# EAGLE design cpu_card (EAGLE 4.16)
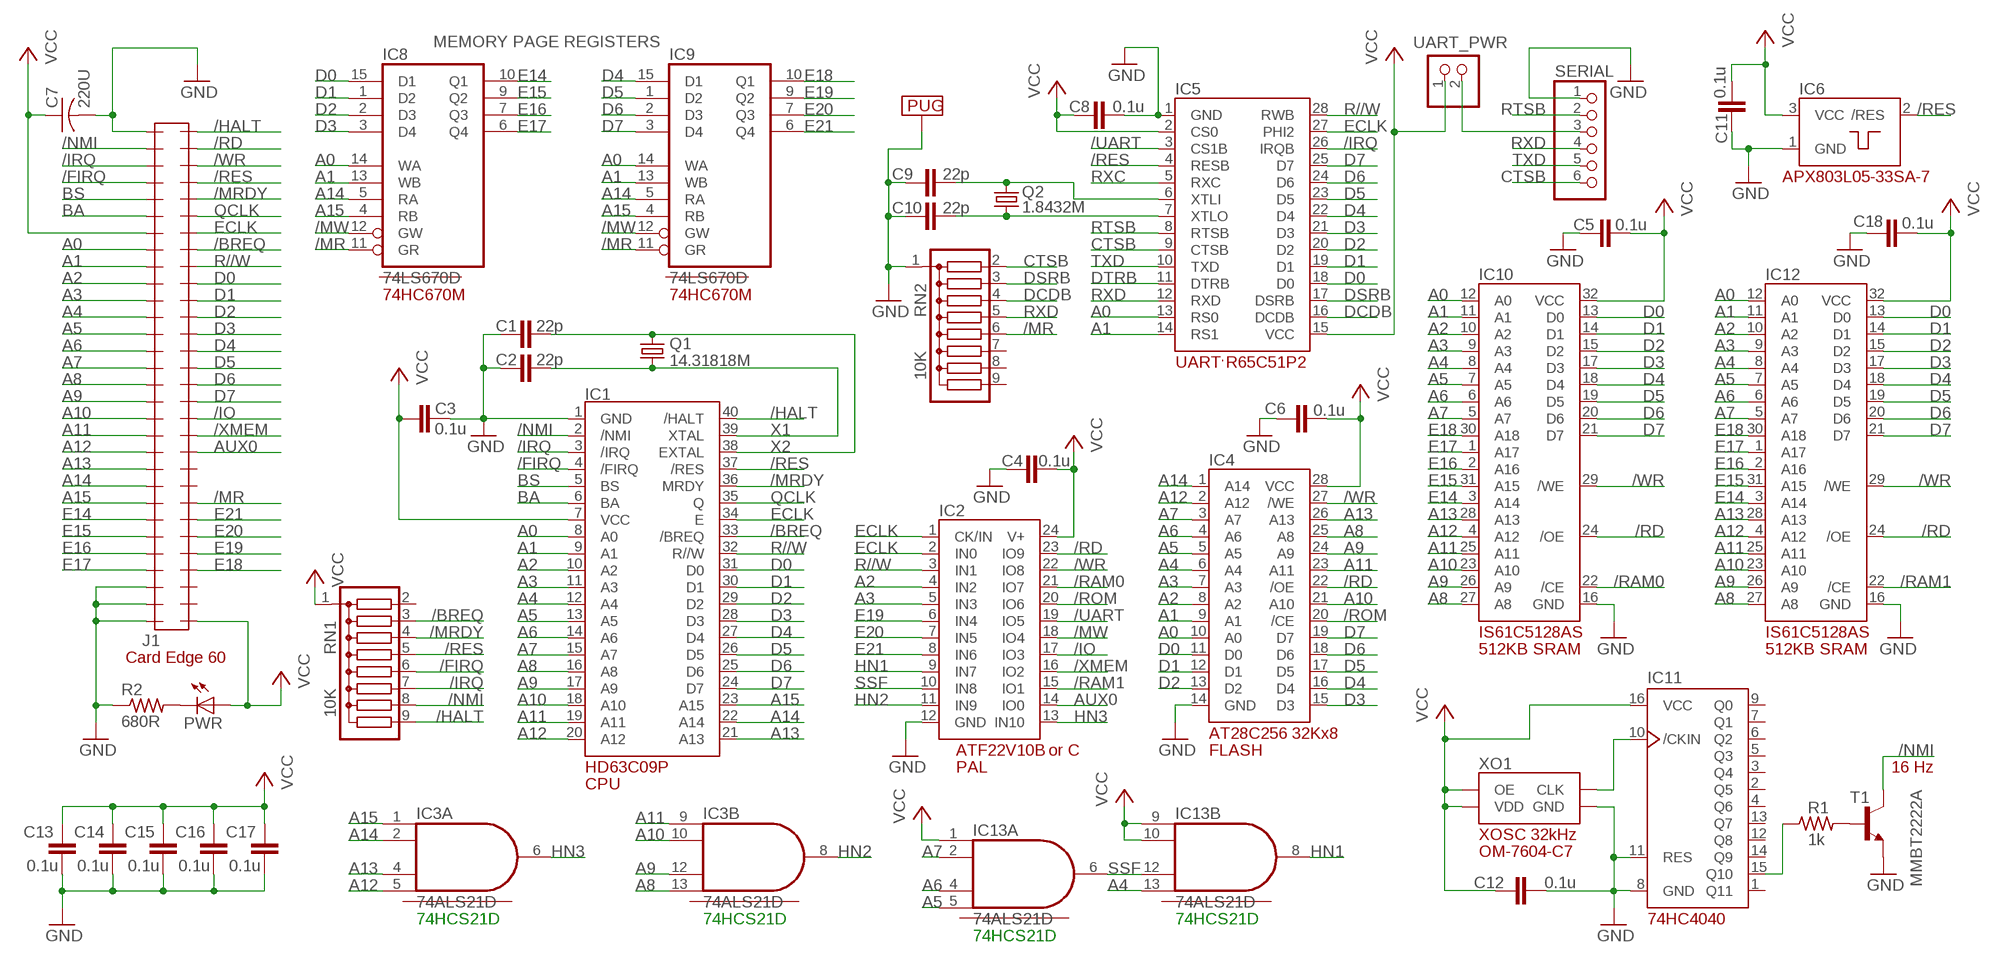
[diagram p0: schematic, sheet 1]

## Parts
C1  22p  C-EUC0603  [C0603]
C2  22p  C-EUC0603  [C0603]
C3  0.1u  C-EUC0603  [C0603]
C4  0.1u  C-EUC0603  [C0603]
C5  0.1u  C-EUC0603  [C0603]
C6  0.1u  C-EUC0603  [C0603]
C7  220U  C-US025-050X050  [C025-050X050]
C8  0.1u  C-EUC0603  [C0603]
C9  22p  C-EUC0603  [C0603]
C10  22p  C-EUC0603  [C0603]
C11  0.1u  C-EUC0603  [C0603]
C12  0.1u  C-EUC0603  [C0603]
C13  0.1u  C-EUC0603  [C0603]
C14  0.1u  C-EUC0603  [C0603]
C15  0.1u  C-EUC0603  [C0603]
C16  0.1u  C-EUC0603  [C0603]
C17  0.1u  C-EUC0603  [C0603]
C18  0.1u  C-EUC0603  [C0603]
IC1  HD63C09P  [DIL40]
IC2  PLD_ATF22V10B  [DIL24-3]
IC3  74ALS21D  [SO14]
IC4  EEP_32KX8_AT28C256  [DIL28-6]
IC5  UART_W65C51N  [DIL28-6]
IC6  POR_APX803L05-33SA-7  [SOT23]
IC8  74LS670D  [SO16]
IC9  74LS670D  [SO16]
IC10  IS61C5128AS  [SOIC32_11.3MM_WID]
IC11  74HC4040D  [SO16]
IC12  IS61C5128AS  [SOIC32_11.3MM_WID]
IC13  74ALS21D  [SO14]
J1  CARDEDGE_2.54_60POS  CARDEDGE_2.54_60POSEDGE  [CARDEDGE_2.54_60POS]
PWR  LED3MM  [LED3MM]
Q1  14.31818M  CRYSTALHC49S  [HC49/S]
Q2  1.8432M  CRYSTALHC49S  [HC49/S]
R1  1k  R-US_R0603  [R0603]
R2  680R  R-US_R0603  [R0603]
RN1  10K  G08R  [SIL9]
RN2  10K  G08R  [SIL9]
SERIAL  PINHD-1X6  [1X06]
T1  MMBT2222A  MMBT2222ALT1-NPN-SOT23-BEC  [SOT23-BEC]
U$2  PUG  [LARGE_PUG]
UART_PWR  PINHD-1X2  [1X02]
XO1  XODC_32KHZ_OM-7604-C7  [32K_XO_OM-7604-C7]

## Nets
/BREQ: IC1.33(/BREQ) J1.53 RN1.3
/FIRQ: IC1.4(/FIRQ) J1.4 RN1.6
/HALT: IC1.40(/HALT) J1.60 RN1.9
/IO: IC2.17(IO3) J1.43
/IRQ: IC1.3(/IRQ) IC5.26(IRQB) J1.3 RN1.7
/MR: IC8.11(GR) IC9.11(GR) J1.38 RN2.6
/MRDY: IC1.36(MRDY) J1.56 RN1.4
/MW: IC2.18(IO4) IC8.12(GW) IC9.12(GW)
/NMI: IC1.2(/NMI) J1.2 RN1.8 T1.C
/RAM0: IC2.21(IO7) IC10.22(/CE)
/RAM1: IC2.15(IO1) IC12.22(/CE)
/RD: IC2.23(IO9) IC4.22(/OE) IC10.24(/OE) IC12.24(/OE) J1.59
/RES: IC1.37(/RES) IC5.4(RESB) IC6.2(/RES) J1.57 RN1.5
/ROM: IC2.20(IO6) IC4.20(/CE)
/UART: IC2.19(IO5) IC5.3(CS1B)
/WR: IC2.22(IO8) IC4.27(/WE) IC10.29(/WE) IC12.29(/WE) J1.58
/XMEM: IC2.16(IO2) J1.42
A0: IC1.8(A0) IC4.10(A0) IC5.13(RS0) IC8.14(WA) IC9.14(WA) IC10.12(A0) IC12.12(A0) J1.8
A1: IC1.9(A1) IC4.9(A1) IC5.14(RS1) IC8.13(WB) IC9.13(WB) IC10.11(A1) IC12.11(A1) J1.9
A2: IC1.10(A2) IC2.4(IN2) IC4.8(A2) IC10.10(A2) IC12.10(A2) J1.10
A3: IC1.11(A3) IC2.5(IN3) IC4.7(A3) IC10.9(A3) IC12.9(A3) J1.11
A4: IC1.12(A4) IC4.6(A4) IC10.8(A4) IC12.8(A4) IC13.13(B:I3) J1.12
A5: IC1.13(A5) IC4.5(A5) IC10.7(A5) IC12.7(A5) IC13.5(A:I3) J1.13
A6: IC1.14(A6) IC4.4(A6) IC10.6(A6) IC12.6(A6) IC13.4(A:I2) J1.14
A7: IC1.15(A7) IC4.3(A7) IC10.5(A7) IC12.5(A7) IC13.2(A:I1) J1.15
A8: IC1.16(A8) IC3.13(B:I3) IC4.25(A8) IC10.27(A8) IC12.27(A8) J1.16
A9: IC1.17(A9) IC3.12(B:I2) IC4.24(A9) IC10.26(A9) IC12.26(A9) J1.17
A10: IC1.18(A10) IC3.10(B:I1) IC4.21(A10) IC10.23(A10) IC12.23(A10) J1.18
A11: IC1.19(A11) IC3.9(B:I0) IC4.23(A11) IC10.25(A11) IC12.25(A11) J1.19
A12: IC1.20(A12) IC3.5(A:I3) IC4.2(A12) IC10.4(A12) IC12.4(A12) J1.20
A13: IC1.21(A13) IC3.4(A:I2) IC4.26(A13) IC10.28(A13) IC12.28(A13) J1.21
A14: IC1.22(A14) IC3.2(A:I1) IC4.1(A14) IC8.5(RA) IC9.5(RA) J1.22
A15: IC1.23(A15) IC3.1(A:I0) IC8.4(RB) IC9.4(RB) J1.23
AUX0: IC2.14(IO0) J1.41
BA: IC1.6(BA) J1.6
BS: IC1.5(BS) J1.5
CTSB: IC5.9(CTSB) RN2.2 SERIAL.6
D0: IC1.31(D0) IC4.11(D0) IC5.18(D0) IC8.15(D1) IC10.13(D0) IC12.13(D0) J1.51
D1: IC1.30(D1) IC4.12(D1) IC5.19(D1) IC8.1(D2) IC10.14(D1) IC12.14(D1) J1.50
D2: IC1.29(D2) IC4.13(D2) IC5.20(D2) IC8.2(D3) IC10.15(D2) IC12.15(D2) J1.49
D3: IC1.28(D3) IC4.15(D3) IC5.21(D3) IC8.3(D4) IC10.17(D3) IC12.17(D3) J1.48
D4: IC1.27(D4) IC4.16(D4) IC5.22(D4) IC9.15(D1) IC10.18(D4) IC12.18(D4) J1.47
D5: IC1.26(D5) IC4.17(D5) IC5.23(D5) IC9.1(D2) IC10.19(D5) IC12.19(D5) J1.46
D6: IC1.25(D6) IC4.18(D6) IC5.24(D6) IC9.2(D3) IC10.20(D6) IC12.20(D6) J1.45
D7: IC1.24(D7) IC4.19(D7) IC5.25(D7) IC9.3(D4) IC10.21(D7) IC12.21(D7) J1.44
DCDB: IC5.16(DCDB) RN2.4
DSRB: IC5.17(DSRB) RN2.3
DTRB: IC5.11(DTRB)
E14: IC8.10(Q1) IC10.3(A14) IC12.3(A14) J1.24
E15: IC8.9(Q2) IC10.31(A15) IC12.31(A15) J1.25
E16: IC8.7(Q3) IC10.2(A16) IC12.2(A16) J1.26
E17: IC8.6(Q4) IC10.1(A17) IC12.1(A17) J1.27
E18: IC9.10(Q1) IC10.30(A18) IC12.30(A18) J1.34
E19: IC2.6(IN4) IC9.9(Q2) J1.35
E20: IC2.7(IN5) IC9.7(Q3) J1.36
E21: IC2.8(IN6) IC9.6(Q4) J1.37
ECLK: IC1.34(E) IC2.1(CK/IN) IC2.2(IN0) IC5.27(PHI2) J1.54
GND [supply]: C1.1 C2.1 C3.2 C4.1 C5.1 C6.1 C7.2 C8.2 C9.1 C10.1 C11.2 C12.2 C13.2 C14.2 C15.2 C16.2 C17.2 C18.1 IC1.1(GND) IC2.12(GND) IC4.14(GND) IC5.1(GND) IC6.1(GND) IC10.16(GND) IC11.8(GND) IC11.11(RES) IC12.16(GND) J1.1 J1.28 J1.29 J1.30 R2.1 RN2.1 SERIAL.1 T1.E U$2.P$1 XO1.GND
HN1: IC2.9(IN7) IC13.8(B:O)
HN2: IC2.11(IN9) IC3.8(B:O)
HN3: IC2.13(IN10) IC3.6(A:O)
N$1: R1.2 T1.B
N$2: PWR.K(C) R2.2
N$3: IC11.15(Q10) R1.1
N$4 [supply]: SERIAL.3 UART_PWR.2
N$5: IC11.10(/CKIN) XO1.CKOUT(CLK)
N$20: C9.2 IC5.6(XTLI) Q2.2
N$21: C10.2 IC5.7(XTLO) Q2.1
QCLK: IC1.35(Q) J1.55
R//W: IC1.32(R//W) IC2.3(IN1) IC5.28(RWB) J1.52
RTSB: IC5.8(RTSB) SERIAL.2
RXC: IC5.5(RXC)
RXD: IC5.12(RXD) RN2.5 SERIAL.4
SSF: IC2.10(IN8) IC13.6(A:O) IC13.12(B:I2)
TXD: IC5.10(TXD) SERIAL.5
VCC [supply]: C3.1 C4.2 C5.2 C6.2 C7.1 C8.1 C11.1 C12.1 C13.1 C14.1 C15.1 C16.1 C17.1 C18.2 IC1.7(VCC) IC2.24(V+) IC4.28(VCC) IC5.2(CS0) IC5.15(VCC) IC6.3(VCC) IC10.32(VCC) IC11.16(VCC) IC12.32(VCC) IC13.1(A:I0) IC13.9(B:I0) IC13.10(B:I1) J1.7 J1.31 PWR.A RN1.1 UART_PWR.1 XO1.OE XO1.VDD
X1: C2.2 IC1.39(XTAL) Q1.1
X2: C1.2 IC1.38(EXTAL) Q1.2
Unconnected: IC11.1(Q11) IC11.2(Q5) IC11.3(Q4) IC11.4(Q6) IC11.5(Q3) IC11.6(Q2) IC11.7(Q1) IC11.9(Q0) IC11.12(Q8) IC11.13(Q7) IC11.14(Q9) J1.32 J1.33 J1.39 J1.40 RN1.2 RN2.7 RN2.8 RN2.9

## Notes on the sheet
- MEMORY PAGE REGISTERS
- 74HC670M | 74HC670M
- 512KB SRAM | 512KB SRAM
- or C | FLASH
- PAL | 16 Hz
- CPU
- 74HCS21D | 74HCS21D | 74HCS21D
- 74HCS21D

## Power pins joined to a net without a drawn wire
GND: IC3.7(P:GND) IC8.8(GND) IC9.8(GND) IC13.7(P:GND)
VCC: IC3.14(P:VCC) IC8.16(VCC) IC9.16(VCC) IC13.14(P:VCC)

## Library data of the parts
C1-C6 C8-C18 = rcl:C-EU: CAPACITOR, European symbol
C7 = rcl:C-US: CAPACITOR, American symbol
IC1 = 07-Retrocomputing:HD63C09P
IC2 = 07-Retrocomputing:PLD_ATF22V10B
IC3 IC13 = 74xx-us:74*21: Dual 4-input AND gate
IC4 = 07-Retrocomputing:EEP_32KX8_AT28C256
IC5 = 07-Retrocomputing:UART_W65C51N
IC6 = 07-Retrocomputing:POR_APX803L05-33SA-7
IC8 IC9 = 74xx-us:74*670: 4 by 4 REGISTER FILES, 3-state
IC10 IC12 = 07-Retrocomputing:IS61C5128AS
IC11 = 07-Retrocomputing:74HC4040
J1 = 07-Retrocomputing:CARDEDGE_2.54_60POS
PWR = led:LED: LED OSRAM: - CHIPLED LG R971, LG N971, LY N971, LG Q971, LY Q971, LO R971, LY R971 LH N974, LH R974 LS Q976, LO Q976, LY Q976 LO Q996 - Hyper CHIPLED LW Q18S LB Q993, LB Q99A, LB R99A - SideLED LS A670, LO A670, LY A670, LG A670, LP A670 LB A673, LV A673, LT A673, LW A673 LH A674 LY A675 LS A676, LA A676, LO A676, LY A676, LW A676 LS A679, LY A679, LG A679 - Hyper Micro SIDELED® LS Y876, LA Y876, LO Y876, LY Y876 LT Y87S - SmartLED LW L88C, LW L88S LB L89C, LB L89S, LG L890 LS L89K, LO L89K, LY L89K LS L896, LA L896, LO L896, LY L896 - TOPLED LS T670, LO T670, LY T670, LG T670, LP T670 LSG T670, LSP T670, LSY T670, LOP T670, LYG T670 LG T671, LOG T671, LSG T671 LB T673, LV T673, LT T673, LW T673 LH T674 LS T676, LA T676, LO T676, LY T676, LB T676, LH T676, LSB T676, LW T676 LB T67C, LV T67C, LT T67C, LS T67K, LO T67K, LY T67K, LW E67C LS E67B, LA E67B, LO E67B, LY E67B, LB E67C, LV E67C, LT E67C LW T67C LS T679, LY T679, LG T679 LS T770, LO T770, LY T770, LG T770, LP T770 LB T773, LV T773, LT T773, LW T773 LH T774 LS E675, LA E675, LY E675, LS T675 LS T776, LA T776, LO T776, LY T776, LB T776 LHGB T686 LT T68C, LB T68C - Hyper Mini TOPLED® LB M676 - Mini TOPLED Santana® LG M470 LS M47K, LO M47K, LY M47K Source: http://www.osram.convergy.de - LUMILED® LXK2-PW12-R00, LXK2-PW12-S00, LXK2-PW14-U00, LXK2-PW14-V00 LXK2-PM12-R00, LXK2-PM12-S00, LXK2-PM14-U00 LXK2-PE12-Q00, LXK2-PE12-R00, LXK2-PE12-S00, LXK2-PE14-T00, LXK2-PE14-U00 LXK2-PB12-K00, LXK2-PB12-L00, LXK2-PB12-M00, LXK2-PB14-N00, LXK2-PB14-P00, LXK2-PB14-Q00 LXK2-PR12-L00, LXK2-PR12-M00, LXK2-PR14-Q00, LXK2-PR14-R00 LXK2-PD12-Q00, LXK2-PD12-R00, LXK2-PD12-S00 LXK2-PH12-R00, LXK2-PH12-S00 LXK2-PL12-P00, LXK2-PL12-Q00, LXK2-PL12-R00 Source: www.luxeon.com
Q1 Q2 = crystal:CRYSTAL: CRYSTAL
R1 R2 = rcl:R-US_: RESISTOR, American symbol
RN1 RN2 = resistor-sil:G08R: SIL RESISTOR
SERIAL = pinhead:PINHD-1X6: PIN HEADER
T1 = transistor:*-NPN-: NPN Transistror
U$2 = 07-Retrocomputing:PUG
UART_PWR = pinhead:PINHD-1X2: PIN HEADER
XO1 = 07-Retrocomputing:XODC_32KHZ_OM-7604-C7

## Net classes
0 default: width 0.203 mm, drill 0.203 mm, clearance 0.254 mm
1 supply: width 0.61 mm, drill 0.203 mm, clearance 0.305 mm

## Board
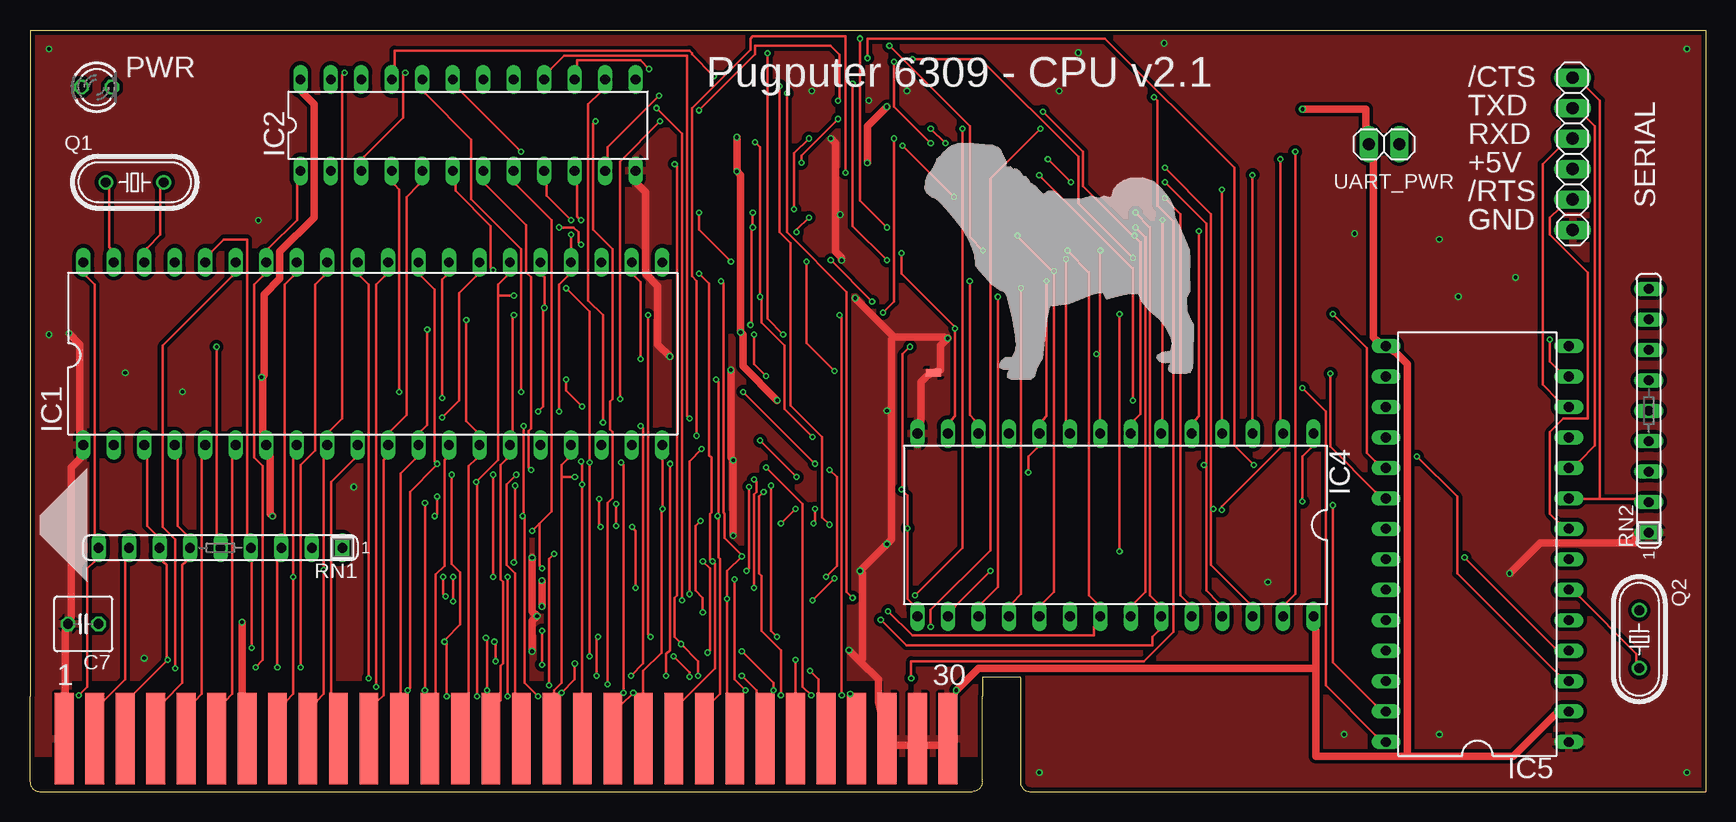
[diagram p1: board, top side]
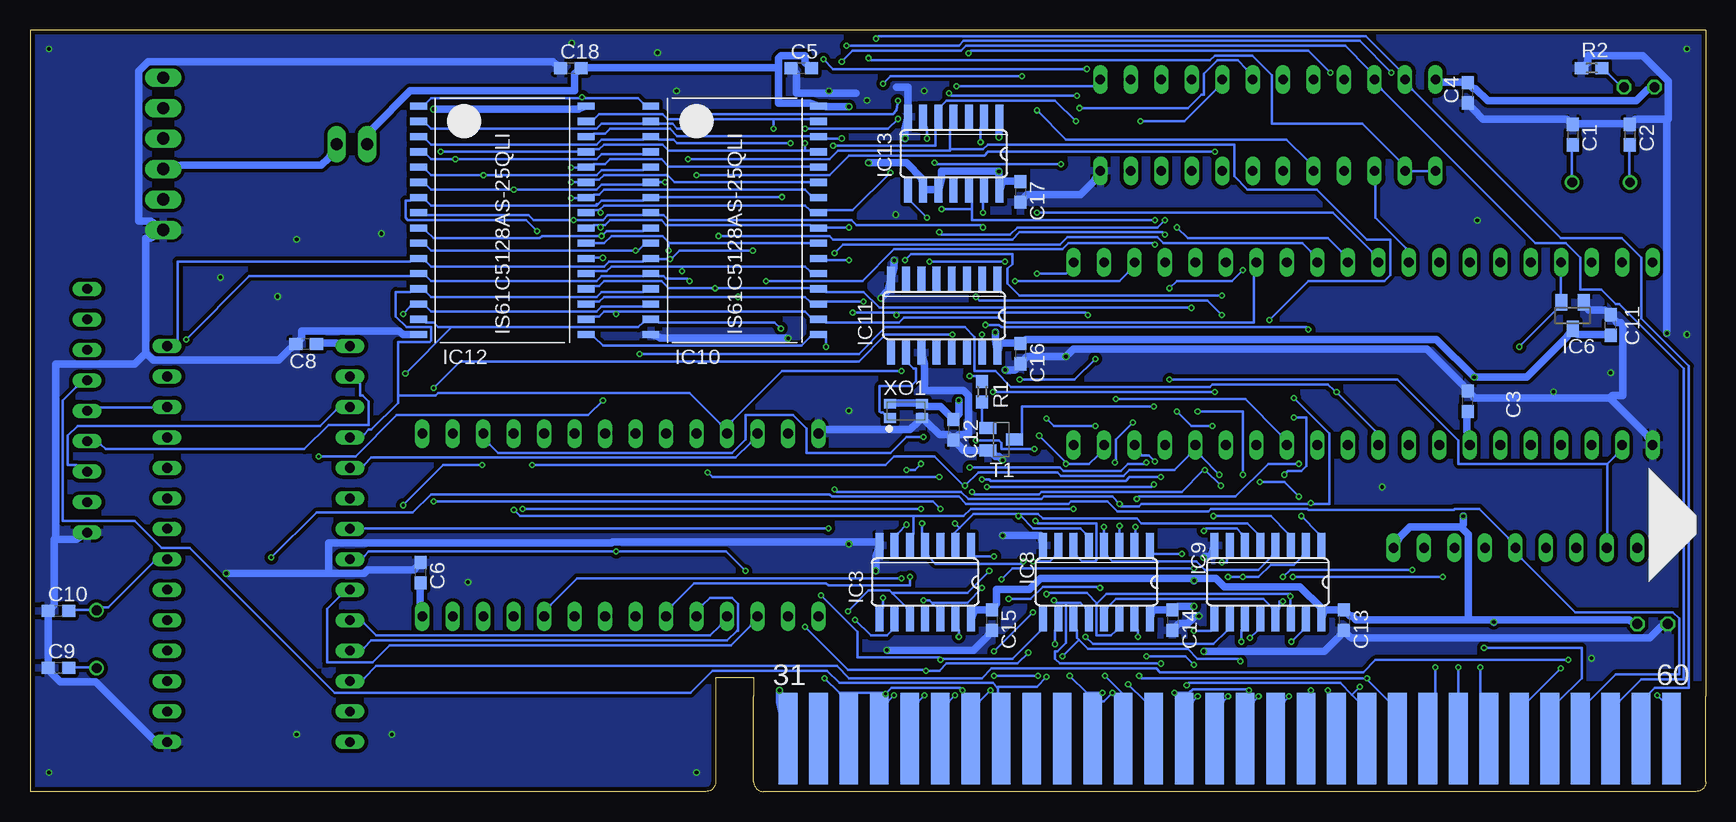
[diagram p2: board, bottom side, seen from below]

Size 139.7 x 63.5 mm. Coordinates in mm from the lower left corner, seen from the top.
Outline: 0,7.94 0,63.5 139.7,63.5 139.7,0 83.34,0 arc-90 82.55,0.79 82.55,9.53 79.38,9.53 79.38,7.94
Copper layers (1*16): Top 0.0356mm / dielectric 1.6mm / Bottom 0.0356mm
Design rules "oshpark-2layer": minimum track width 6mil, minimum drill 10mil, track to track 6mil, track to pad 6mil, pad to pad 6mil, via to via 6mil, smd to smd 6mil, copper to edge 15mil, drill to drill 6mil, minimum pad ring 5mil, minimum via ring 5mil, stop-mask expansion 2.5mil, vias tented up to drill 0mil, thermal gap 10mil

### Footprints (pad centres in the part's own frame; a part is rotated, then mirrored left to right if it is on the bottom)
C0603 = smd 1.1 x 1: 1 -0.85,0; 2 0.85,0
C025-050X050 = drill 0.813 octagon: 1 -1.27,0; 2 1.27,0
DIL40 = drill 0.813 long: 1 -24.13,-7.62; 2 -21.59,-7.62; 3 -19.05,-7.62; 4 -16.51,-7.62; 5 -13.97,-7.62; 6 -11.43,-7.62; 7 -8.89,-7.62; 8 -6.35,-7.62; 9 -3.81,-7.62; 10 -1.27,-7.62; 11 1.27,-7.62; 12 3.81,-7.62; 13 6.35,-7.62; 14 8.89,-7.62; 15 11.43,-7.62; 16 13.97,-7.62; 17 16.51,-7.62; 18 19.05,-7.62; 19 21.59,-7.62; 20 24.13,-7.62; 21 24.13,7.62; 22 21.59,7.62; 23 19.05,7.62; 24 16.51,7.62; 25 13.97,7.62; 26 11.43,7.62; 27 8.89,7.62; 28 6.35,7.62; 29 3.81,7.62; 30 1.27,7.62; 31 -1.27,7.62; 32 -3.81,7.62; 33 -6.35,7.62; 34 -8.89,7.62; 35 -11.43,7.62; 36 -13.97,7.62; 37 -16.51,7.62; 38 -19.05,7.62; 39 -21.59,7.62; 40 -24.13,7.62
DIL24-3 = drill 0.813 long: 1 -13.97,-3.81; 2 -11.43,-3.81; 3 -8.89,-3.81; 4 -6.35,-3.81; 5 -3.81,-3.81; 6 -1.27,-3.81; 7 1.27,-3.81; 8 3.81,-3.81; 9 6.35,-3.81; 10 8.89,-3.81; 11 11.43,-3.81; 12 13.97,-3.81; 13 13.97,3.81; 14 11.43,3.81; 15 8.89,3.81; 16 6.35,3.81; 17 3.81,3.81; 18 1.27,3.81; 19 -1.27,3.81; 20 -3.81,3.81; 21 -6.35,3.81; 22 -8.89,3.81; 23 -11.43,3.81; 24 -13.97,3.81
SO14 = smd 0.66 x 2.032: 1 -3.81,-3.073; 2 -2.54,-3.073; 3 -1.27,-3.073; 4 0,-3.073; 5 1.27,-3.073; 6 2.54,-3.073; 7 3.81,-3.073; 8 3.81,3.073; 9 2.54,3.073; 10 1.27,3.073; 11 0,3.073; 12 -1.27,3.073; 13 -2.54,3.073; 14 -3.81,3.073
DIL28-6 = drill 0.813 long: 1 -16.51,-7.62; 2 -13.97,-7.62; 3 -11.43,-7.62; 4 -8.89,-7.62; 5 -6.35,-7.62; 6 -3.81,-7.62; 7 -1.27,-7.62; 8 1.27,-7.62; 9 3.81,-7.62; 10 6.35,-7.62; 11 8.89,-7.62; 12 11.43,-7.62; 13 13.97,-7.62; 14 16.51,-7.62; 15 16.51,7.62; 16 13.97,7.62; 17 11.43,7.62; 18 8.89,7.62; 19 6.35,7.62; 20 3.81,7.62; 21 1.27,7.62; 22 -1.27,7.62; 23 -3.81,7.62; 24 -6.35,7.62; 25 -8.89,7.62; 26 -11.43,7.62; 27 -13.97,7.62; 28 -16.51,7.62
SOT23 = smd 1 x 1.4: 1 -0.95,-1.1; 2 0.95,-1.1; 3 0,1.1
SO16 = smd 0.66 x 2.032: 1 -4.445,-3.073; 2 -3.175,-3.073; 3 -1.905,-3.073; 4 -0.635,-3.073; 5 0.635,-3.073; 6 1.905,-3.073; 7 3.175,-3.073; 8 4.445,-3.073; 9 4.445,3.073; 10 3.175,3.073; 11 1.905,3.073; 12 0.635,3.073; 13 -0.635,3.073; 14 -1.905,3.073; 15 -3.175,3.073; 16 -4.445,3.073
SOIC32_11.3MM_WID = smd 1.4 x 0.6: 1 -6.985,9.525; 2 -6.985,8.255; 3 -6.985,6.985; 4 -6.985,5.715; 5 -6.985,4.445; 6 -6.985,3.175; 7 -6.985,1.905; 8 -6.985,0.635; 9 -6.985,-0.635; 10 -6.985,-1.905; 11 -6.985,-3.175; 12 -6.985,-4.445; 13 -6.985,-5.715; 14 -6.985,-6.985; 15 -6.985,-8.255; 16 -6.985,-9.525; 17 6.985,-9.525; 18 6.985,-8.255; 19 6.985,-6.985; 20 6.985,-5.715; 21 6.985,-4.445; 22 6.985,-3.175; 23 6.985,-1.905; 24 6.985,-0.635; 25 6.985,0.635; 26 6.985,1.905; 27 6.985,3.175; 28 6.985,4.445; 29 6.985,5.715; 30 6.985,6.985; 31 6.985,8.255; 32 6.985,9.525
CARDEDGE_2.54_60POS = smd 1.556 x 7.62: 1 -36.83,4.41; 2 -34.29,4.41; 3 -31.75,4.41; 4 -29.21,4.41; 5 -26.67,4.41; 6 -24.13,4.41; 7 -21.59,4.41; 8 -19.05,4.41; 9 -16.51,4.41; 10 -13.97,4.41; 11 -11.43,4.41; 12 -8.89,4.41; 13 -6.35,4.41; 14 -3.81,4.41; 15 -1.27,4.41; 16 1.27,4.41; 17 3.81,4.41; 18 6.35,4.41; 19 8.89,4.41; 20 11.43,4.41; 21 13.97,4.41; 22 16.51,4.41; 23 19.05,4.41; 24 21.59,4.41; 25 24.13,4.41; 26 26.67,4.41; 27 29.21,4.41; 28 31.75,4.41; 29 34.29,4.41; 30 36.83,4.41 | smd 1.556 x 7.62 bottom: 31 36.83,4.41; 32 34.29,4.41; 33 31.75,4.41; 34 29.21,4.41; 35 26.67,4.41; 36 24.13,4.41; 37 21.59,4.41; 38 19.05,4.41; 39 16.51,4.41; 40 13.97,4.41; 41 11.43,4.41; 42 8.89,4.41; 43 6.35,4.41; 44 3.81,4.41; 45 1.27,4.41; 46 -1.27,4.41; 47 -3.81,4.41; 48 -6.35,4.41; 49 -8.89,4.41; 50 -11.43,4.41; 51 -13.97,4.41; 52 -16.51,4.41; 53 -19.05,4.41; 54 -21.59,4.41; 55 -24.13,4.41; 56 -26.67,4.41; 57 -29.21,4.41; 58 -31.75,4.41; 59 -34.29,4.41; 60 -36.83,4.41
LED3MM = drill 0.813 octagon: A -1.27,0; K 1.27,0
HC49/S = drill 0.813 round: 1 -2.413,0; 2 2.413,0
R0603 = smd 1.1 x 1: 1 -0.85,0; 2 0.85,0
SIL9 = drill 0.813 long: 1 -10.16,0; 2 -7.62,0; 3 -5.08,0; 4 -2.54,0; 5 0,0; 6 2.54,0; 7 5.08,0; 8 7.62,0; 9 10.16,0
1X06 = drill 1.016 long: 1 -6.35,0; 2 -3.81,0; 3 -1.27,0; 4 1.27,0; 5 3.81,0; 6 6.35,0
SOT23-BEC = smd 1 x 1.4: B -0.95,-1.1; C 0,1.1; E 0.95,-1.1
LARGE_PUG = smd 1.27 x 0.635: P$1 2.286,3.962
1X02 = drill 1.016 long: 1 -1.27,0; 2 1.27,0
32K_XO_OM-7604-C7 = smd 1 x 0.8: CKOUT -1.35,-0.6; GND 1.35,-0.6; OE 1.35,0.6; VDD -1.35,0.6

### Placement (x,y rotation side)
C1  11.11,54.77 270 bottom
C2  6.35,54.77 270 bottom
C3  19.84,32.54 90 bottom
C4  19.84,58.26 90 bottom
C5  75.41,60.33 0 bottom
C6  107.16,18.26 270 bottom
C7  4.45,13.97 180 top
C8  116.68,37.31 180 bottom
C9  137.32,10.32 0 bottom
C10  137.32,15.08 0 bottom
C11  7.94,38.89 90 bottom
C12  62.71,30.16 270 bottom
C13  30.16,14.29 270 bottom
C14  44.45,14.29 270 bottom
C15  59.53,14.29 270 bottom
C16  57.15,36.51 270 bottom
C17  57.15,50.01 270 bottom
C18  94.61,60.33 0 bottom
IC1  28.57,36.51 0 top
IC2  36.51,55.56 0 top
IC3  65.09,17.46 180 bottom
IC4  90.49,22.23 180 top
IC5  120.65,20.64 90 top
IC6  11.11,39.69 180 bottom
IC8  50.8,17.46 180 bottom
IC9  36.51,17.46 180 bottom
IC10  80.96,47.62 0 bottom
IC11  63.5,39.69 180 bottom
IC12  100.33,47.62 0 bottom
IC13  62.71,53.18 180 bottom
J1  39.69,0 0 top
PWR  5.56,58.74 0 top
Q1  8.73,50.8 0 top
Q2  134.14,12.7 270 top
R1  60.33,33.34 270 bottom
R2  9.53,60.33 0 bottom
RN1  15.88,20.32 180 top
RN2  134.94,31.75 90 top
SERIAL  128.59,53.18 90 top
T1  58.74,29.37 270 bottom
U$2  73.03,30.96 0 top
UART_PWR  112.87,53.98 0 top
XO1  66.67,31.75 0 bottom

### Tracks (layer width: path | path; a pad name or v marks a point on that pad's centre or on a via)
/BREQ  (via drill 0.25)
  Top 0.203: IC1.33 21.95,42.98 21.23,42.27 21.23,21.44 RN1.3 20.62,19.2 v20.62,10.36
  Bottom 0.203: v20.62,10.36 20.62,7.52 J1.53
/FIRQ
  Top 0.203: IC1.4 12.29,27.74 12.29,22.15 13.01,21.44 RN1.6 13.01,19.2 12.7,18.9 12.7,9.04 11.18,7.52 J1.4
/HALT  (via drill 0.25)
  Top 0.203: IC1.40 4.67,42.98 5.38,42.27 5.38,21.44 RN1.9 5.38,19.2 4.78,18.59 4.78,8.74 v4.06,8.03
  Bottom 0.203: v4.06,8.03 3.56,7.52 J1.60
/IO  (via drill 0.25)
  Top 0.203: v47.14,55.88 46.94,55.68 46.94,46.84 48.56,45.21 48.56,32.72 48.36,32.51 48.36,30.18 48.56,29.97 48.56,24.49 48.16,24.08 v48.16,8.94
  Bottom 0.203: v47.14,55.88 43.48,55.88 40.84,58.52 IC2.17 | v48.16,8.94 46.74,7.52 J1.43
/IRQ  (via drill 0.25)
  Top 0.203: IC1.3 9.75,27.74 9.75,22.15 10.46,21.44 RN1.7 11.07,19.2 11.38,18.9 11.38,11.18 v11.48,10.97 8.64,8.13 8.64,7.52 J1.3
  Bottom 0.203: v11.48,10.97 27.53,10.97 28.55,9.96 45.52,9.96 45.82,10.26 59.54,10.26 60.35,9.45 71.42,9.45 72.44,10.46 110.85,10.46 111.86,9.45 IC5.26
/MR  (via drill 0.25)
  Top 0.203: v38.71,12.5 38.81,12.39 v38.81,10.87 | v53.65,11.28 54.97,9.96 v54.97,9.55
  Bottom 0.203: v38.71,12.5 38.71,13.41 IC9.11 | v38.81,10.87 39.01,11.07 42.37,11.07 43.18,11.89 51.51,11.89 52.27,12.65 | 52.27,12.65 52.43,12.8 52.43,13.41 IC8.11 | 59.08,8.69 59.03,8.64 59.03,7.52 J1.38 | 59.08,8.69 59.44,9.04 72.24,9.04 73.25,10.06 82.8,10.06 84.63,8.23 114.3,8.23 126.39,20.32 128.73,20.32 130.96,22.55 136.96,22.55 136.96,32.61 135.84,33.73 RN2.6 | v54.97,9.55 55.78,8.74 59.03,8.74 59.08,8.69 | 52.27,12.65 v53.65,11.28
/MRDY  (via drill 0.25)
  Top 0.203: IC1.36 15.14,45.01 16.15,46.02 18.09,46.02 18.09,21.44 RN1.4 18.49,19.2 v18.49,11.99
  Bottom 0.203: v18.49,11.99 10.36,11.99 10.36,9.45 12.29,7.52 J1.56
/MW  (via drill 0.25)
  Top 0.203: v38,12.8 38.1,12.7 v38.1,8.43 | v44.3,8.23 45.41,9.35 v45.41,10.67 | v52.22,57 54.36,54.86 v54.36,15.95
  Bottom 0.203: v38,12.8 37.39,13.41 IC9.12 | v38.1,8.43 38.2,8.53 42.77,8.53 43.08,8.23 v44.3,8.23 | v45.41,10.67 53.85,10.67 54.25,11.07 54.25,11.68 54.05,11.68 53.34,12.39 53.34,15.75 | 53.34,15.75 52.12,15.75 51.71,15.34 IC8.12 | v52.22,57 43.18,57 42.06,58.12 41.86,58.12 41.86,59.84 40.74,60.96 39.01,60.96 38.3,60.25 IC2.18 | v54.36,15.95 54.15,15.75 53.34,15.75
/NMI  (via drill 0.25)
  Top 0.203: v46.02,32.11 44.7,33.43 v44.7,34.34 | J1.2 6.1,7.52 7.92,9.35 7.92,19.2 RN1.8
  Bottom 0.203: v46.02,32.11 57,32.11 57,29.77 T1.C | v44.7,34.34 25.7,34.34 20.62,29.26 20.62,27.33 8.23,27.33 | 8.23,27.33 7.52,28.04 IC1.2 | 8.23,27.33 8.23,21.44 RN1.8
/RAM0  (via drill 0.25)
  Top 0.203: v71.42,44.3 68.58,47.14 v68.58,59.03 | v57,59.64 55.17,61.47 55.17,61.57 54.97,61.77 30.38,61.77 30.38,60.55 IC2.21
  Bottom 0.203: v71.42,44.3 73.36,44.3 IC10.22 | v68.58,59.03 67.97,59.64 v57,59.64
/RAM1  (via drill 0.25)
  Top 0.203: v91.95,44.5 87.38,49.07 87.38,52.93 79.25,61.06 v73.56,61.06 | v51.61,60.25 50.9,60.96 45.62,60.96 45.62,60.55 IC2.15
  Bottom 0.203: v91.95,44.5 92.66,44.5 IC12.22 | v73.56,61.06 72.75,60.25 v51.61,60.25
/RD  (via drill 0.25)
  Top 0.203: v92.15,47.04 92.96,46.23 92.96,16.66 92.05,15.75 IC4.22 | v71.42,47.04 69.19,49.28 v69.19,62.79
  Bottom 0.203: 92.15,47.24 92.66,47.24 IC12.24 | 92.15,47.24 91.75,47.24 91.34,47.65 87.07,47.65 86.67,47.24 74.68,47.24 IC10.24 73.36,47.04 v71.42,47.04 | 92.15,47.24 v92.15,47.04 | J1.59 5.38,7.52 4.27,8.64 1.42,8.64 1.42,35.46 5.38,39.42 5.38,44.5 7.01,46.13 12.09,46.13 24.49,58.52 IC2.23 25.6,60.25 28.35,62.99 68.99,62.99 v69.19,62.79
/RES  (via drill 0.25)
  Top 0.203: v119.58,19.51 127.1,11.99 IC5.4 | v15.54,37.08 15.54,21.44 RN1.5
  Bottom 0.203: IC1.37 12.09,42.98 12.09,41.45 IC6.2 12.5,40.13 v15.54,37.08 | J1.57 9.75,7.52 7.52,9.75 2.23,9.75 2.23,14.43 2.74,14.94 10.87,14.94 15.34,19.41 RN1.5 16.46,21.13 18.9,23.57 20.93,23.57 21.03,23.47 33.12,23.47 33.22,23.57 41.25,23.57 41.45,23.37 49.07,23.37 49.89,24.18 52.93,24.18 53.14,23.98 61.67,23.98 62.28,24.59 72.85,24.59 73.05,24.79 106.27,24.79 107.8,23.27 115.82,23.27 v119.58,19.51
/ROM  (via drill 0.25)
  Top 0.203: v40.95,33.33 40.95,45.21 36.78,49.38 36.78,54.36 32.92,58.22 IC2.20 | v59.44,33.33 v65.43,27.33 | v66.65,26.82 67.26,26.21 67.26,18.8 v66.34,17.88
  Bottom 0.203: v40.95,33.33 v59.44,33.33 | v65.43,27.33 65.94,26.82 v66.65,26.82 | v66.34,17.88 66.34,17.17 73.15,17.17 73.36,17.37 84.33,17.37 86.16,15.54 IC4.20
/UART  (via drill 0.25)
  Top 0.203: v40.95,53.34 35.76,58.52 IC2.19 | v84.12,51.41 91.95,43.59 v91.95,32.61 | v115.62,27.94 118.97,24.59 118.97,18.19 127.41,9.75 IC5.3
  Bottom 0.203: v40.95,53.34 59.84,53.34 60.15,53.03 71.42,53.03 73.05,51.41 v84.12,51.41 | v91.95,32.61 93.17,31.39 109.12,31.39 112.57,27.94 v115.62,27.94
/WR  (via drill 0.25)
  Top 0.203: v105.46,53.34 105.46,16.46 104.75,15.75 IC4.27 | v75.08,54.05 72.03,57.1 v72.03,60.86
  Bottom 0.203: 75.08,53.44 86.46,53.44 86.97,53.95 91.85,53.95 92.25,53.54 92.66,53.54 IC12.29 v105.46,53.34 | 75.08,53.44 74.68,53.44 IC10.29 | J1.58 7.21,7.52 5.38,9.35 1.83,9.35 1.83,35.26 7.21,40.64 7.52,40.64 8.74,41.86 10.46,41.86 10.46,44.5 11.68,45.72 14.22,45.72 27.03,58.52 IC2.22 28.14,60.25 30.07,62.18 61.67,62.18 62.08,61.77 71.12,61.77 v72.03,60.86 | v75.08,54.05 75.08,53.44
/XMEM  (via drill 0.25)
  Top 0.203: v54.97,31.09 54.76,31.29 54.76,61.37 44.5,61.37 43.38,60.25 IC2.16 | v50.9,30.48 51.1,30.28 51.1,10.67 v50.09,9.65
  Bottom 0.203: v54.97,31.09 54.36,30.48 v50.9,30.48 | v50.09,9.65 47.95,7.52 J1.42
A0  (via drill 0.25)
  Top 0.203: v84.73,42.57 84.73,31.29 84.43,30.99 IC4.10 83.92,28.65 83.21,27.94 v83.21,26.62 | v126.69,37.69 126.69,35.87 127.41,35.15 IC5.13 | IC1.8 21.95,27.74 v21.95,17.88 21.95,8.13 21.34,7.52 J1.8 | v34.65,16.26 34.44,16.46 v34.44,17.88 | v60.86,29.26 v63.91,26.21 | v55.98,28.55 54.97,27.53 v54.97,16.46
  Bottom 0.203: v84.73,42.57 84.94,42.77 86.67,42.77 86.87,42.98 87.27,42.98 IC10.12 88.59,42.98 92.05,42.98 92.46,42.57 106.27,42.57 106.68,42.98 IC12.12 108,42.98 121.41,42.98 v126.69,37.69 | 50.75,15.7 50.8,15.65 50.8,13.01 49.58,13.01 49.17,13.41 IC8.14 | 50.75,15.7 49.99,16.46 34.65,16.46 v34.65,16.26 34.65,15.34 IC9.14 | v21.95,17.88 v34.44,17.88 | v83.21,26.62 82.8,26.21 v63.91,26.21 | v60.86,29.26 58.93,29.26 58.73,29.06 58.73,28.55 v55.98,28.55 | v54.97,16.46 54.86,16.56 51.61,16.56 50.75,15.7
A1  (via drill 0.25)
  Top 0.203: v86.36,44.4 86.36,30.99 IC4.9 | J1.9 23.88,7.52 24.49,8.13 v24.49,18.49 24.49,27.74 IC1.9 24.99,30.07 26.01,31.09 26.01,59.74 v26.21,59.94 | v35.26,17.88 v35.26,15.85 | v79.45,45.11 78.33,46.23 78.33,55.47 v71.63,62.18
  Bottom 0.203: IC5.14 127.41,37.69 127.41,44.2 108,44.2 IC12.11 106.68,44.2 106.27,43.79 91.85,43.79 91.44,44.2 88.59,44.2 IC10.11 87.27,44.4 v86.36,44.4 86.16,44.5 85.55,45.11 v79.45,45.11 | IC8.13 49.89,15.34 49.17,16.05 36.88,16.05 36.17,15.34 IC9.13 35.56,15.34 35.56,15.85 v35.26,15.85 | v35.26,17.88 34.65,18.49 v24.49,18.49 | v71.63,62.18 62.28,62.18 61.87,62.59 28.85,62.59 v26.21,59.94
A2  (via drill 0.25)
  Top 0.203: 89.2,36.47 v89.2,45.11 | 89.2,36.47 89.2,30.99 IC4.8 | IC1.10 27.03,27.74 25.09,25.81 25.09,7.52 J1.10 | v30.79,33.33 30.79,50.19 30.38,50.6 IC2.4 | v88.9,36.47 89.2,36.47
  Bottom 0.203: IC10.10 88.59,45.52 89,45.11 v89.2,45.11 106.27,45.11 106.68,45.52 IC12.10 | IC1.10 27.53,30.07 v30.79,33.33 30.99,33.43 31.5,33.93 41.15,33.93 41.35,33.73 57.91,33.73 59.23,35.05 60.96,35.05 60.96,37.9 61.77,38.71 68.38,38.71 70.61,36.47 v88.9,36.47
A3  (via drill 0.25)
  Top 0.203: IC4.7 92.05,30.99 92.56,31.5 92.56,45.82 v92.05,46.33 91.85,46.43 87.78,50.49 87.78,53.34 v84.43,56.69 | J1.11 28.96,7.52 29.46,8.03 29.46,27.64 29.57,27.74 IC1.11 30.07,30.07 31.39,31.39 31.39,49.58 32.41,50.6 IC2.5 | v55.78,56.79 60.45,61.47 60.45,62.18 66.74,62.18 67.47,61.45 67.47,57.7 v67.36,57.59
  Bottom 0.203: IC10.9 88.59,46.74 91.64,46.74 v92.05,46.33 97.03,46.33 97.23,46.13 106.07,46.13 106.68,46.74 IC12.9 | v84.43,56.69 84.23,56.49 67.77,56.49 67.46,56.79 v67.36,57.59 | v55.78,56.79 53.34,54.36 34.95,54.36 33.22,52.63 IC2.5
A4  (via drill 0.25)
  Top 0.203: J1.12 30.89,7.52 30.89,26.52 32.11,27.74 IC1.12 32.61,30.07 33.12,30.58 v33.12,38.51 | v60.25,48.26 v60.25,47.04 60.15,46.84 60.15,39.01 v60.05,38.91 | v94.39,47.65 94.39,30.99 IC4.6
  Bottom 0.203: IC12.8 106.68,48.06 98.15,48.06 97.74,47.65 v94.39,47.65 91.95,47.65 91.54,48.06 88.59,48.06 IC10.8 87.27,48.06 86.87,48.06 86.46,47.65 71.22,47.65 70.81,47.24 60.45,47.24 v60.25,47.04 | v60.25,48.26 60.25,49.17 IC13.13 | v33.12,38.51 33.33,38.71 58.73,38.71 58.93,38.91 v60.05,38.91
A5  (via drill 0.25)
  Top 0.203: IC1.13 34.65,27.74 34.54,27.64 34.54,18.8 33.83,18.09 33.83,7.52 J1.13 | v72.75,53.85 v77.01,49.58 | v97.43,46.74 97.43,31.29 97.13,30.99 IC4.5 | v49.17,32.72 49.17,52.53 v52.53,55.88
  Bottom 0.203: v72.75,53.85 64.21,53.85 64.21,55.27 IC13.5 63.7,57.2 63.3,57.61 54.25,57.61 v52.53,55.88 | v77.01,49.58 87.27,49.58 IC10.7 88.59,49.28 92.05,49.28 92.35,48.97 92.46,48.97 92.46,48.87 106.27,48.87 106.68,49.28 IC12.7 108,49.28 108.41,49.28 108.41,47.85 108.2,47.65 98.35,47.65 v97.43,46.74 | v49.17,32.72 38.41,32.72 35.46,29.77 IC1.13
A6  (via drill 0.25)
  Top 0.203: J1.14 36.58,7.52 36.58,27.13 37.19,27.74 IC1.14 37.19,30.07 36.37,30.89 v36.37,39.32 | v84.84,52.73 v86.77,50.8 | v99.36,50.19 99.36,30.99 IC4.4
  Bottom 0.203: IC12.6 106.68,50.6 106.27,50.19 v99.36,50.19 92.46,50.19 92.05,50.6 88.59,50.6 IC10.6 v86.77,50.8 | 62.99,53.54 62.99,53.44 72.34,53.44 73.05,52.73 v84.84,52.73 | 62.99,53.54 62.99,55.27 IC13.4 | v36.37,39.32 33.12,42.57 26.82,42.57 26.31,43.08 26.31,46.02 28.25,46.02 32.41,50.19 38.2,50.19 39.32,51.31 39.32,53.95 59.84,53.95 60.25,53.54 62.99,53.54
A7  (via drill 0.25)
  Top 0.203: v101.91,51.41 101.91,30.99 IC4.3 | v60.45,54.15 60.86,53.75 v60.86,41.25 60.96,41.05 60.96,39.12 62.89,37.19 62.89,31.9 v65.23,29.57 | v40.34,39.73 40.23,39.62 40.23,30.07 IC1.15 39.73,27.74 39.22,27.23 39.22,17.68 39.42,17.48 39.42,10.67 39.22,10.46 39.22,7.62 39.12,7.52 J1.15
  Bottom 0.203: IC10.5 88.59,51.82 92.05,51.82 92.46,51.41 v101.91,51.41 106.27,51.41 106.68,51.82 IC12.5 | v60.45,54.15 60.45,55.27 IC13.2 | v60.86,41.25 60.55,40.95 41.55,40.95 v40.34,39.73 | v65.23,29.57 66.65,29.57 67.97,28.25 74.98,28.25 74.98,30.28 76.1,31.39 80.06,31.39 80.06,29.36 81.18,28.25 100.69,28.25 101.4,28.96 IC4.3
A8  (via drill 0.25)
  Top 0.203: v62.28,12.9 61.77,13.41 v61.77,25.5 | v40.54,26.42 39.73,25.6 39.73,18.9 40.44,18.19 40.44,7.52 J1.16 | 98.04,27.23 98.04,47.35 v94.59,50.8 | 98.04,27.23 98.04,16.76 99.06,15.75 IC4.25 | v97.84,27.23 98.04,27.23
  Bottom 0.203: v62.28,12.9 62.28,13.41 IC3.13 | v40.54,26.42 42.06,27.94 IC1.16 43.08,28.04 44.3,26.82 48.06,26.82 48.56,26.31 53.75,26.31 54.05,26.62 60.66,26.62 v61.77,25.5 61.98,25.6 64.31,27.94 67.67,27.94 68.38,27.23 v97.84,27.23 | IC10.27 85.95,50.8 86.56,51.41 91.85,51.41 92.25,51 92.66,51 IC12.27 v94.59,50.8
A9  (via drill 0.25)
  Top 0.203: 44.3,26.21 44.3,9.04 43.69,8.43 43.69,7.52 J1.17 | 44.3,26.21 44.3,27.23 44.81,27.74 IC1.17 | v65.23,15.95 v67.06,17.78 | v94.59,49.48 95.91,48.16 95.91,16.36 96.52,15.75 IC4.24 | 44.3,26.21 v45.41,26.21 | v60.35,26.01 60.55,25.81 60.55,24.99 60.35,24.79 v60.35,16.97
  Bottom 0.203: IC10.26 74.68,49.78 75.08,50.19 91.85,50.19 92.25,49.78 92.66,49.78 IC12.26 93.98,49.48 v94.59,49.48 | 64.47,15.7 64.72,15.95 v65.23,15.95 | 64.47,15.7 64.11,15.34 IC3.12 | v67.06,17.78 94.08,17.78 96.32,15.54 IC4.24 | v45.41,26.21 48.06,26.21 48.36,25.91 59.64,25.91 59.74,26.01 v60.35,26.01 | v60.35,16.97 61.57,15.75 64.41,15.75 64.47,15.7
A10  (via drill 0.25)
  Top 0.203: v45.92,27.53 46.02,27.43 v46.02,25.6 46.02,7.52 J1.18 | v71.53,15.04 73.56,13.01 88.7,13.01 88.7,13.72 IC4.21 88.9,15.75 88.29,16.36 88.29,43.28 v86.46,45.11 | v59.94,25.4 59.94,18.59 v59.74,18.39
  Bottom 0.203: v45.92,27.53 46.43,28.04 47.04,28.04 IC1.18 | 86.41,45.77 86.97,46.33 91.24,46.33 91.85,45.72 IC12.23 | 86.41,45.77 86.36,45.72 IC10.23 | 67.82,16.51 68.07,16.76 69.8,16.76 v71.53,15.04 | 67.82,16.51 66.65,15.34 IC3.10 | v86.46,45.11 86.46,45.72 86.41,45.77 | v46.02,25.6 46.23,25.4 v59.94,25.4 | v59.74,18.39 61.57,16.56 67.77,16.56 67.82,16.51
A11  (via drill 0.25)
  Top 0.203: v53.34,27.33 53.34,11.79 53.03,11.48 v53.03,9.65 | v50.29,8.23 49.28,7.21 J1.19 | v70.92,14.33 73.05,12.19 93.57,12.19 93.57,12.9 94.08,13.41 IC4.23 93.98,15.75 93.37,16.36 93.37,47.04 v92.15,48.26 | v55.58,29.67 55.58,42.57 55.17,42.98 55.17,57 60.05,61.87 60.05,62.79 60.25,62.99 67.97,62.99 v67.97,51.61
  Bottom 0.203: v53.03,9.65 51.61,8.23 v50.29,8.23 | IC1.19 50.7,28.04 51.41,27.33 v53.34,27.33 53.44,27.53 v55.58,29.67 | 92.2,48.51 92.25,48.46 92.66,48.46 IC12.25 | 92.2,48.51 91.85,48.87 75.08,48.87 74.68,48.46 IC10.25 73.36,48.46 71.12,48.46 v67.97,51.61 | v70.92,14.33 69.6,13.01 68.28,13.01 67.87,13.41 IC3.9 | v92.15,48.26 92.15,48.46 92.2,48.51
A12  (via drill 0.25)
  Top 0.203: v104.24,52.73 104.24,30.99 IC4.2 104.24,28.65 99.36,23.77 v99.36,23.47 | IC1.20 52.73,27.74 v52.73,23.57 52.63,23.37 52.63,11.58 51.1,10.06 51.1,7.52 J1.20
  Bottom 0.203: IC10.4 88.59,53.14 92.05,53.14 92.46,52.73 v104.24,52.73 106.27,52.73 106.68,53.14 IC12.4 | 66.04,22.96 66.04,21.54 IC3.5 | 66.04,22.96 61.87,22.96 61.27,23.57 v52.73,23.57 | v99.36,23.47 98.86,22.96 66.04,22.96
A13  (via drill 0.25)
  Top 0.203: J1.21 54.36,7.52 57.1,10.26 57.1,19 v56.9,19.2 56.69,19.3 56.69,23.16 56.79,23.27 56.79,27.84 56.59,28.04 56.59,42.37 v55.78,43.18 | 98.45,23.57 98.45,48.16 v94.59,52.02 | 98.45,23.57 98.45,18.9 101.6,15.75 IC4.26 | v65.33,22.35 65.43,22.45 v65.43,23.57 | v98.65,23.57 98.45,23.57
  Bottom 0.203: v56.9,19.2 57.1,19 64.21,19 64.82,19.61 IC3.4 65.33,21.54 v65.33,22.35 | v55.78,43.18 53.34,43.18 53.24,43.28 IC1.21 | IC10.28 74.68,52.12 86.46,52.12 87.07,52.73 91.34,52.73 91.75,52.32 92.66,52.32 IC12.28 93.98,52.02 v94.59,52.02 | v65.43,23.57 v98.65,23.57
A14  (via drill 0.25)
  Top 0.203: v50.9,36.07 50.9,42.47 50.39,42.98 IC1.22 | v57.2,34.34 57.4,34.14 57.4,22.96 | 57.4,22.96 57.4,19.51 57.51,19.41 57.51,8.13 56.9,7.52 J1.22 | v106.07,24.18 106.07,27.94 106.78,28.65 IC4.1 | v62.59,22.35 v63.8,23.57 | v57.3,22.96 57.4,22.96
  Bottom 0.203: v50.9,36.07 52.63,34.34 v57.2,34.34 | 57.3,23.16 61.06,23.16 62.23,22 | 57.3,23.16 55.68,23.16 55.27,22.76 47.45,22.76 47.04,22.35 38.2,22.35 37.39,21.54 IC9.5 | 62.23,22 62.69,21.54 IC3.2 | 57.3,23.16 57.15,23.01 | 57.15,23.01 56.08,21.95 52.12,21.95 51.71,21.54 IC8.5 | v106.07,24.18 64.41,24.18 v63.8,23.57 | 62.23,22 v62.59,22.35 | v57.3,22.96 57.2,22.96 57.15,23.01
A15  (via drill 0.25)
  Top 0.203: J1.23 58.12,7.52 v58.12,16.05 58.12,18.39 v59.33,19.61 59.23,19.81 57.91,21.13 57.91,23.16 57.81,23.27 57.81,42.37 v57.61,42.57 | v50.19,22.05 50.49,21.74 v50.49,16.97
  Bottom 0.203: IC9.4 36.17,19.61 37.29,18.49 41.76,18.49 42.47,19.2 49.48,19.2 49.89,19.61 IC8.4 50.19,21.54 v50.19,22.05 | v59.33,19.61 60.96,19.61 IC3.1 | v57.61,42.57 48.87,42.57 48.16,43.28 IC1.23 | v50.49,16.97 50.6,17.07 55.27,17.07 56.29,16.05 v58.12,16.05
AUX0  (via drill 0.25)
  Top 0.203: v47.75,30.79 47.75,39.73 46.53,40.95 46.53,57.3 47.55,58.32 IC2.14 | v49.28,27.43 49.48,27.23 v49.48,8.23
  Bottom 0.203: v47.75,30.79 49.17,29.36 49.17,27.43 v49.28,27.43 | v49.48,8.23 50.19,7.52 50.39,7.52 J1.41
BA
  Top 0.203: IC1.6 16.87,27.74 16.87,8.13 16.26,7.52 J1.6
BS
  Top 0.203: IC1.5 14.33,27.74 14.33,8.13 13.72,7.52 J1.5
CTSB
  Top 0.203: 130.86,24.38 133.81,24.38 RN2.2 | 130.86,24.38 129.44,24.38 IC5.9 | 130.86,24.38 130.86,57.61 129.64,58.83 SERIAL.6
D0  (via drill 0.25)
  Top 0.203: v47.35,12.9 47.24,12.8 v47.24,9.65 | v28.25,9.45 28.25,42.27 27.53,42.98 IC1.31 | v67.06,35.05 64.72,37.39 v64.72,44.2 | v58.42,44.2 55.78,46.84 v55.78,48.26
  Bottom 0.203: IC10.13 88.59,41.66 92.05,41.66 92.46,41.25 106.27,41.25 106.68,41.66 IC12.13 108,41.66 109.22,41.66 109.22,39.62 108.31,38.71 106.27,38.71 106.27,37.59 106.38,37.49 109.02,37.49 109.02,33.02 | 109.02,33.02 109.02,32.41 111.25,30.18 111.45,30.18 111.86,29.77 IC5.18 | 109.02,33.02 105.87,33.02 105.66,33.22 84.73,33.22 82.19,30.68 IC4.11 81.18,30.89 77.01,35.05 v67.06,35.05 | v47.35,12.9 47.35,13.41 IC8.15 | v47.24,9.65 47.04,9.45 28.35,9.45 28.3,9.4 | 28.3,9.4 26.42,7.52 J1.51 | 28.3,9.4 v28.25,9.45 | v58.42,44.2 v64.72,44.2 | v55.78,48.26 31.09,48.26 27.84,45.01 IC1.31
D1  (via drill 0.25)
  Top 0.203: v108.61,39.83 111.45,36.98 111.45,28.25 112.17,27.53 IC5.19 | v43.69,19.81 43.28,19.41 v43.28,8.84 | v28.85,8.74 28.85,42.27 29.57,42.98 IC1.30 | v78.33,42.57 78.33,31.39 78.74,30.99 IC4.12 | v45.92,45.62 45.72,45.82 45.72,46.63 45.31,47.04 v44.09,47.04
  Bottom 0.203: IC10.14 88.59,40.44 92.05,40.44 92.46,40.03 106.27,40.03 106.68,40.44 IC12.14 108,40.44 v108.61,39.83 | IC4.12 79.65,29.06 80.87,27.84 111.25,27.84 111.86,27.23 IC5.19 | v43.69,19.81 46.13,19.81 IC8.1 | v43.28,8.84 43.08,9.04 30.48,9.04 29.52,8.08 | 29.52,8.08 28.96,7.52 J1.50 | 29.52,8.08 v28.85,8.74 | v78.33,42.57 70.31,42.57 67.67,45.21 53.65,45.21 53.14,45.72 46.02,45.72 v45.92,45.62 | v44.09,47.04 43.18,46.13 31.5,46.13 30.38,45.01 IC1.30
D2  (via drill 0.25)
  Top 0.203: IC4.13 76.81,30.99 77.11,31.29 v77.11,38.61 77.01,38.81 72.64,43.18 v72.64,44.91 | v108.41,34.85 108.41,28.75 112.17,24.99 IC5.20 | v47.55,22.05 47.45,22.15 v47.45,24.38 | IC1.29 32.61,42.98 33.73,41.86 33.73,27.53 v33.93,27.33 33.83,27.13 31.7,24.99 31.7,8.64 v31.5,8.43
  Bottom 0.203: 104.55,38.71 105.66,38.71 106.07,39.12 106.68,39.12 IC12.15 | 104.55,38.71 89,38.71 88.59,39.12 IC10.15 87.27,39.12 77.62,39.12 v77.11,38.61 | 104.55,38.71 v108.41,34.85 | v47.55,22.05 47.55,21.54 IC8.2 | v47.45,24.38 47.24,24.59 39.22,24.59 36.47,27.33 v33.93,27.33 | v31.5,8.43 31.5,7.52 J1.49 | v72.64,44.91 71.93,45.62 53.85,45.62 53.24,46.23 45.72,46.23 45.21,45.72 33.63,45.72 32.92,45.01 IC1.29
D3  (via drill 0.25)
  Top 0.203: v48.87,23.98 v48.87,22.15 | IC4.15 73.56,15.65 73.15,16.05 v73.15,21.95 73.15,24.69 v72.64,25.2 72.75,25.4 72.75,36.47 v73.36,37.08 | v34.34,32.82 34.34,42.67 34.65,42.98 IC1.28 | v32.92,8.43 v32.92,24.08
  Bottom 0.203: IC12.17 92.66,37.9 91.95,37.19 75.39,37.19 74.68,37.9 IC10.17 73.36,37.9 v73.36,37.08 | v48.87,22.15 48.87,21.54 IC8.3 | v72.64,25.2 72.44,24.99 62.08,24.99 61.47,24.38 55.37,24.38 55.17,24.59 49.48,24.59 v48.87,23.98 48.77,23.77 47.24,23.77 47.04,23.98 32.92,23.98 | v73.15,21.95 111.86,21.95 IC5.21 | v34.34,32.82 31.39,29.87 31.39,23.98 32.92,23.98 | v32.92,8.43 32.92,7.52 J1.48 | v32.92,24.08 32.92,23.98
D4  (via drill 0.25)
  Top 0.203: v80.06,18.39 77.11,15.44 IC4.16 | v34.75,7.92 34.75,12.29 v34.54,12.5 34.65,12.7 35.87,13.92 35.87,18.29 35.15,19 v35.15,26.42 | v34.34,31.19 35.76,32.61 35.76,41.55 37.19,42.98 IC1.27 | v90.83,39.83 v90.83,20.02
  Bottom 0.203: v80.06,18.39 81.69,20.02 v90.83,20.02 111.45,20.02 111.86,19.61 IC5.22 | v34.54,12.5 33.63,13.41 IC9.15 | v34.75,7.92 35.15,7.52 J1.47 | 90.83,40.03 91.85,40.03 92.25,39.62 92.66,39.62 IC12.18 | 90.83,40.03 75.08,40.03 74.68,39.62 IC10.18 73.36,39.12 67.26,39.12 66.85,39.52 58.83,39.52 58.42,39.12 37.69,39.12 37.69,42.98 IC1.27 | v35.15,26.42 34.85,26.72 33.73,26.72 33.33,27.13 33.33,31.19 v34.34,31.19 | 90.83,40.03 v90.83,39.83
D5  (via drill 0.25)
  Top 0.203: v33.73,22.96 33.93,23.16 v33.93,24.59 | 39.01,41.35 39.01,42.27 39.73,42.98 IC1.26 | 39.01,41.35 39.01,27.64 v37.19,25.81 37.29,25.6 v37.29,7.92 | v80.67,41.25 80.67,17.07 79.35,15.75 IC4.17 | 39.01,41.35 v40.34,41.35 | v66.75,44.3 v70.21,40.84
  Bottom 0.203: v33.73,22.96 32.31,21.54 IC9.1 | v33.93,24.59 35.15,25.81 v37.19,25.81 | v37.29,7.92 37.69,7.52 J1.46 | IC12.19 92.66,40.84 92.25,40.84 91.85,41.25 v80.67,41.25 75.08,41.25 74.68,40.84 IC10.19 73.36,40.84 v70.21,40.84 | IC5.23 113.89,16.26 114.91,15.24 114.91,10.77 111.15,10.77 109.73,12.19 81.28,12.19 79.65,13.82 IC4.17 | v40.34,41.35 57.2,41.35 58.22,42.37 58.22,43.59 57.81,43.99 57.81,44.81 66.24,44.81 v66.75,44.3
D6  (via drill 0.25)
  Top 0.203: v39.83,7.92 v39.83,17.88 | IC1.25 42.77,42.98 42.88,42.88 v42.88,40.34 42.77,40.13 42.77,32.11 v42.37,31.7 | v38.61,17.88 v38.61,26.42 | v82.6,41.96 82.6,16.46 81.89,15.75 IC4.18
  Bottom 0.203: IC5.24 111.86,14.02 110.85,13.01 83.01,13.01 82.19,13.82 IC4.18 | v39.83,17.88 v38.61,17.88 37.29,17.88 36.27,18.9 34.34,18.9 33.63,19.61 IC9.2 | v39.83,7.92 40.23,7.52 J1.45 | IC12.20 92.66,42.16 92.25,42.16 91.85,42.57 87.07,42.57 86.46,41.96 v82.6,41.96 74.68,41.96 IC10.20 73.36,41.66 70.21,41.66 68.89,40.34 v42.88,40.34 | v38.61,26.42 38.61,31.7 v42.37,31.7
D7  (via drill 0.25)
  Top 0.203: v42.37,7.92 41.25,9.04 41.25,22.76 v41.05,22.96 41.15,23.16 v41.15,30.48 | v44.09,31.7 44.09,42.27 44.81,42.98 IC1.24 45.11,45.31 v45.11,46.43 | IC4.19 84.43,15.75 85.34,16.66 v85.34,43.38 85.14,43.48 v82.3,46.33
  Bottom 0.203: v41.05,22.96 36.27,22.96 34.85,21.54 IC9.3 | v42.37,7.92 42.77,7.52 J1.44 | v44.09,31.7 42.88,30.48 v41.15,30.48 | 85.34,43.79 91.24,43.79 91.64,43.38 92.66,43.38 IC12.21 | 85.34,43.79 75.08,43.79 74.68,43.38 IC10.21 | IC4.19 83.62,15.54 83.01,16.15 81.18,16.15 80.67,15.65 80.67,13.41 80.77,13.41 81.58,12.6 111.25,12.6 111.86,11.99 IC5.25 | v85.34,43.38 85.34,43.79 | v45.11,46.43 45.31,46.63 57.2,46.63 57.81,46.02 72.75,46.02 73.05,46.33 v82.3,46.33
DCDB
  Bottom 0.203: IC5.16 112.17,34.04 112.17,33.02 111.96,33.02 111.45,32.51 111.45,30.58 114.81,30.58 116.84,28.55 133.4,28.55 133.81,28.96 RN2.4
DSRB
  Bottom 0.203: IC5.17 114.2,31.8 115.52,30.48 135.74,30.48 136.55,29.67 136.55,27.23 135.84,27.23 RN2.3
E14  (via drill 0.25)
  Top 0.203: v55.68,9.65 55.68,10.87 v54.25,12.29 54.15,12.5 53.75,12.9 53.75,16.15 53.95,16.36 53.95,52.12 v53.75,52.32 | v59.33,9.65 60.55,8.43 60.55,7.52 J1.24 | v75.08,55.27 v76.3,54.05 | v67.36,56.08 64.31,53.03 v64.31,52.43
  Bottom 0.203: IC12.3 106.68,54.36 106.27,53.95 92.46,53.95 92.05,54.36 88.59,54.36 IC10.3 87.27,54.36 86.06,54.36 85.75,54.05 v76.3,54.05 | v54.25,12.29 54.25,13.41 IC8.10 | v55.68,9.65 v59.33,9.65 | v75.08,55.27 68.17,55.27 v67.36,56.08 | v64.31,52.43 64.21,52.32 v53.75,52.32
E15  (via drill 0.25)
  Top 0.203: v63.8,10.97 63.8,7.52 J1.25 | v77.72,55.27 77.72,20.32 v73.76,16.36
  Bottom 0.203: 77.72,56.08 86.56,56.08 86.97,56.49 92.25,56.49 92.66,56.08 IC12.31 | 77.72,56.08 74.68,56.08 IC10.31 | IC8.9 55.47,13.41 57.81,11.07 63.7,11.07 v63.8,10.97 63.91,11.18 70.71,11.18 70.71,13.31 v73.76,16.36 | v77.72,55.27 77.72,56.08
E16  (via drill 0.25)
  Top 0.203: v56.08,19.2 56.69,18.59 56.69,11.79 v56.49,11.58 | v65.02,10.06 65.73,9.35 65.73,7.52 J1.26 | v84.23,55.27 80.06,51.1 80.06,20.12 75.08,15.14 v75.08,13.72
  Bottom 0.203: IC12.2 106.68,55.68 106.27,55.27 92.46,55.27 92.05,55.68 88.59,55.68 IC10.2 87.27,55.68 86.16,55.68 85.75,55.27 v84.23,55.27 | v56.08,19.2 54.66,19.2 54.25,19.61 IC8.7 | v56.49,11.58 57.4,10.67 63.3,10.67 63.91,10.06 v65.02,10.06 65.23,10.16 71.53,10.16 v75.08,13.72
E17  (via drill 0.25)
  Top 0.203: v55.88,22.55 55.47,22.15 55.47,16.76 56.08,16.15 v56.08,14.94 | v59.33,11.68 61.98,9.04 v61.98,8.43 | v68.38,8.13 68.38,7.52 J1.27 | v93.67,57.91 93.98,57.61 93.98,48.87 95.3,47.55 95.3,13.31 92.86,10.87 73.46,10.87 v73.46,9.45
  Bottom 0.203: 93.67,57.81 106.27,57.81 106.68,57.4 IC12.1 | 93.67,57.81 89,57.81 88.59,57.4 IC10.1 | v55.88,22.55 55.68,22.35 50.8,22.35 50.8,19.3 50.9,19.2 52.02,19.2 52.43,19.61 IC8.6 | v59.33,11.68 v56.08,14.94 | v61.98,8.43 62.18,8.64 67.87,8.64 v68.38,8.13 68.58,8.23 72.24,8.23 v73.46,9.45 | v93.67,57.91 93.67,57.81
E18  (via drill 0.25)
  Top 0.203: v51.71,12.9 51.51,13.11 v51.51,39.73 | v71.12,39.93 72.03,40.84 v72.03,54.46 | v67.67,8.03 67.67,39.52 v67.46,39.73
  Bottom 0.203: IC12.30 92.66,54.86 91.75,54.86 91.34,55.27 86.36,55.27 85.75,54.66 74.68,54.66 IC10.30 73.36,54.46 v72.03,54.46 | v51.71,12.9 51.1,12.29 41.05,12.29 39.93,13.41 IC9.10 | v51.51,39.73 51.71,39.93 67.46,39.93 | 67.46,39.93 v71.12,39.93 | v67.67,8.03 68.17,7.52 J1.34 | 67.46,39.93 v67.46,39.73
E19  (via drill 0.25)
  Top 0.203: v42.67,10.57 v42.67,13.41 | v46.63,11.28 v46.63,27.43 46.63,40.03 v44.7,41.96 | v38.61,43.48 38.41,43.69 38.41,47.14 35.46,50.09 35.46,50.6 IC2.6 | v65.13,8.03 64.41,8.74 64.41,23.98 v61.37,27.03
  Bottom 0.203: v42.67,13.41 41.25,13.41 IC9.9 | v42.67,10.57 43.38,11.28 v46.63,11.28 | v44.7,41.96 44.09,42.57 39.52,42.57 v38.61,43.48 | v65.13,8.03 65.63,7.52 J1.35 | v61.37,27.03 53.85,27.03 53.54,26.72 48.77,26.72 48.16,27.33 46.74,27.33 v46.63,27.43
E20  (via drill 0.25)
  Top 0.203: v40.34,19.1 40.44,19.2 v40.44,25.5 | v41.76,26.82 41.55,27.03 41.55,30.07 41.76,30.28 41.76,42.88 41.35,43.28 41.35,47.24 38,50.6 IC2.7 | v62.59,8.03 62.59,11.79 60.96,13.41 60.96,17.98 60.76,18.19 60.76,24.59 v61.16,24.99
  Bottom 0.203: v40.34,19.1 39.93,19.1 39.93,19.61 IC9.7 | v40.44,25.5 v41.76,26.82 41.96,26.72 43.69,24.99 55.37,24.99 55.58,24.79 60.96,24.79 v61.16,24.99 | v62.59,8.03 63.09,7.52 J1.36
E21  (via drill 0.25)
  Top 0.203: 42.42,22.3 43.48,23.37 43.48,47.65 40.54,50.6 IC2.8 | v41.86,21.74 42.42,22.3 | v59.64,8.43 58.73,9.35 v58.73,17.68 | v42.67,18.59 42.47,18.8 42.47,22.25 42.42,22.3
  Bottom 0.203: v41.86,21.74 41.66,21.95 39.12,21.95 38.71,21.54 IC9.6 | v59.64,8.43 60.55,7.52 J1.37 | v58.73,17.68 57.81,18.59 v42.67,18.59
ECLK  (via drill 0.25)
  Top 0.203: IC2.1 22.25,50.6 22.25,47.65 19.91,45.31 IC1.34 19.41,42.98 18.69,42.27 18.69,27.84 19.41,27.13 19.41,10.97 v18.8,10.36 | v108.61,23.88 108.61,10.77 112.17,7.21 IC5.27 | v102.01,27.23 100.38,28.85 100.38,52.02 89.61,62.79 69.8,62.79 v69.8,61.16
  Bottom 0.203: IC2.1 23.06,51.71 24.49,51.71 IC2.2 25.6,52.63 28.65,55.68 36.17,55.68 36.17,59.74 37.8,61.37 40.95,61.37 41.35,60.96 69.6,60.96 v69.8,61.16 | v108.61,23.88 105.26,27.23 v102.01,27.23 | v18.8,10.36 18.8,7.52 J1.54
GND  (via drill 0.3)
  Top 0.61: v3.25,38.2 4.17,37.29 4.17,30.07 IC1.1 4.17,27.74 3.45,27.03 3.45,14.53 C7.2 2.95,13.41 2.95,7.52 J1.1 | v41.86,19.51 41.86,15.04 v42.27,14.63 41.86,14.22 v41.86,11.68 | v123.34,18.19 125.88,20.73 133.81,20.73 133.81,21.34 RN2.1 | v53.34,36.27 52.32,37.29 52.32,42.16 51.31,43.18 51.31,49.99 50.7,50.6 IC2.12 | v58.62,21.34 v58.62,27.64 58.42,27.84 v58.42,35.15 | J1.30 75.79,3.86 74.68,3.86 J1.29 73.25,3.86 72.14,3.86 J1.28 70.71,7.52 70.71,9.35 69.19,10.87 | 69.19,10.87 v68.28,11.79 | 69.19,10.87 69.39,11.07 69.39,18.19 v69.19,18.39 71.83,21.03 71.83,37.69 72.03,37.9 | IC4.14 74.27,30.99 74.27,34.14 74.78,34.65 U$2.P$1 75.89,35.15 75.89,37.19 76.4,37.69 | 76.4,37.69 v76.5,37.8 | 72.03,37.9 v68.78,41.15 | 72.03,37.9 76.2,37.9 76.4,37.69 | v66.75,54.46 67.16,54.05 67.16,45.01 67.67,44.5 v67.67,44.3
  Bottom 0.61: 3.15,56.08 3.15,59.23 5.28,61.37 9.86,61.37 9.86,60.76 R2.1 | 3.15,56.08 5.89,56.08 C2.1 6.81,55.68 10.67,55.68 C1.1 11.58,56.08 18.59,56.08 19.41,56.9 C4.1 | IC6.1 9.75,40.13 8.43,40.13 C11.2 7.52,39.22 7.42,39.12 7.11,39.12 6.91,38.91 6.91,33.02 7.82,33.02 8.03,32.82 | 8.03,32.82 19.3,32.82 19.41,32.92 C3.2 20.32,33.93 23.27,36.88 52.73,36.88 v53.34,36.27 56.59,36.27 56.69,36.17 C16.2 57.61,35.15 v58.42,35.15 | 8.03,32.82 4.98,29.77 IC1.1 | v3.25,38.2 3.25,55.88 3.15,56.08 | v42.27,14.63 42.57,14.63 43.18,14.02 43.89,14.02 43.99,13.92 C14.2 | v41.86,19.51 41.76,19.61 41.25,19.61 IC9.8 | C7.2 3.76,13.72 4.67,12.8 29.57,12.8 29.67,12.9 C13.2 30.58,12.9 31.8,11.68 v41.86,11.68 | IC5.1 129.44,4.37 134.21,9.14 137.16,9.14 137.87,9.86 C9.1 138.18,10.77 138.18,14.63 C10.1 137.67,15.54 137.67,21.03 | 114.81,18.19 v123.34,18.19 | 114.81,18.19 111.86,18.19 111.56,18.49 107.7,18.49 107.59,18.59 C6.1 | 137.67,21.03 135.84,21.03 RN2.1 | IC12.16 108.61,38.1 108.92,38.41 117.04,38.41 117.04,37.8 C8.2 118.06,36.88 118.97,35.97 129.44,35.97 130.05,36.58 | C18.1 96.01,60.76 96.11,60.86 129.84,60.86 130.66,60.05 130.66,47.55 129.64,47.55 SERIAL.1 129.64,46.13 130.05,46.13 130.05,36.58 | 137.67,21.03 137.57,21.23 137.57,35.66 130.96,35.66 130.05,36.58 | C17.2 56.69,49.68 56.59,49.78 52.12,49.78 51,50.9 IC2.12 | C12.2 63.2,29.77 63.91,29.77 64.92,30.79 XO1.GND 65.73,30.79 66.34,30.18 73.46,30.18 IC4.14 | C12.2 62.28,28.85 61.87,28.45 60.45,28.45 T1.E 59.23,27.94 58.93,27.94 v58.62,27.64 | v58.62,21.34 55.47,21.34 IC8.8 | IC11.11 65.13,35.66 65.13,33.43 61.87,33.43 61.47,33.02 61.47,29.77 62.28,29.77 C12.2
  Bottom 0.61: v68.28,11.79 61.06,11.79 59.94,12.9 C15.2 | v69.19,18.39 69.19,19.61 IC3.7 69.19,20.83 91.14,20.83 91.24,20.73 114.81,20.73 114.81,18.19 | 70.84,58.22 75.79,58.22 75.79,59.84 C5.1 | v76.5,37.8 87.17,37.8 87.27,37.9 IC10.16 | v68.78,41.15 68.17,41.76 IC11.8 67.67,43.69 v67.67,44.3 | v66.75,54.46 66.75,55.27 IC13.7 66.52,58.74 67.47,58.74
  other vias: 138.11,1.59 84.14,1.59 138.11,61.91 1.59,61.91 9.53,11.11 12.7,33.34 7.94,34.92 19.05,47.62 71.44,31.75 71.44,20.64 103.19,17.46 119.06,41.27 123.83,42.86 117.47,46.04 109.54,4.76 117.47,4.76 26.99,25.4 1.59,38.1 65.16,58.43 67.55,48.11 69.93,57.63 87.39,61.6 94.53,62.4 73.1,58.43 85.8,58.43 110.41,46.52
  pour Top: 0,63.5 139.7,63.5 139.7,0 82.55,0 82.55,9.53 79.38,9.53 79.38,3.17 71.44,3.17 71.44,9.53 3.17,9.53 3.17,3.17 0,3.17
  pour Bottom: 0,63.5 139.7,63.5 139.7,0 82.55,0 82.55,9.53 79.38,9.53 0,9.53
HN1  (via drill 0.25)
  Top 0.203: v64.92,47.85 63.91,46.84 v63.91,46.63 | v45.11,47.65 43.08,49.68 43.08,50.6 IC2.9
  Bottom 0.203: v64.92,47.85 66.24,49.17 IC13.8 | v63.91,46.63 63.7,46.43 58.01,46.43 57.4,47.04 45.72,47.04 v45.11,47.65
HN2  (via drill 0.25)
  Top 0.203: v68.58,16.15 68.07,16.66 68.07,41.66 63.09,46.63 v63.09,58.22 | v52.43,58.01 48.16,53.75 48.16,52.93 IC2.11
  Bottom 0.203: v68.58,16.15 68.58,15.34 IC3.8 | v63.09,58.22 62.89,58.01 v52.43,58.01
HN3  (via drill 0.25)
  Top 0.203: v66.65,22.25 66.04,22.86 66.04,29.57 63.4,32.21 63.4,45.72 62.48,46.63 v62.48,58.83
  Bottom 0.203: v66.65,22.25 67.36,21.54 IC3.6 | v62.48,58.83 51,58.83 IC2.13
N$1
  Bottom 0.203: R1.2 60.35,32 60.35,30.79 T1.B
N$2
  Bottom 0.203: R2.2 8.13,59.84 7.32,59.03 PWR.K
N$3  (via drill 0.25)
  Top 0.203: v61.37,34.65 60.35,35.66 v60.35,38.1
  Bottom 0.203: v61.37,34.65 60.76,34.65 R1.1 | v60.35,38.1 60.35,37.59 IC11.15
N$4
  Bottom 0.61: UART_PWR.2 114.81,52.83 115.42,52.22 127.1,52.22 SERIAL.3
N$5
  Bottom 0.203: XO1.CKOUT 68.48,31.5 68.58,31.6 68.78,31.6 68.89,31.7 68.89,33.83 66.24,33.83 65.84,34.24 65.84,35.26 66.04,35.26 66.45,35.66 IC11.10
N$20
  Top 0.203: IC5.6 129.13,16.26 133.91,11.48 133.91,10.87 Q2.2
  Bottom 0.203: C9.2 135.94,10.36 134.72,10.36 Q2.2
N$21
  Bottom 0.203: C10.2 135.94,15.14 134.72,15.14 Q2.1 133.6,15.34 133.2,15.34 129.44,19.1 IC5.7
QCLK  (via drill 0.25)
  Top 0.203: v12.09,10.26 12.09,21.03 11.07,22.05 11.07,37.19 16.87,42.98 IC1.35
  Bottom 0.203: v12.09,10.26 14.83,7.52 J1.55
R//W  (via drill 0.25)
  Top 0.203: v106.07,33.63 108,31.7 108,8.84 112.17,4.67 IC5.28 | v62.79,38.1 61.47,39.42 v61.47,61.57 | v31.29,59.94 31.09,59.74 31.09,56.19 27.84,52.93 IC2.3 | v22.55,10.36 22.55,27.23 23.77,28.45 23.77,42.27 24.49,42.98 IC1.32
  Bottom 0.203: IC1.32 24.99,45.31 27.53,47.85 27.53,50.6 IC2.3 | v106.07,33.63 103.83,35.87 70.61,35.87 68.38,38.1 v62.79,38.1 | v61.47,61.57 61.27,61.77 33.12,61.77 v31.29,59.94 | v22.55,10.36 22.55,7.52 J1.52
RTSB
  Top 0.203: IC5.8 127.41,22.45 126.69,23.16 126.69,29.97 127.81,31.09 129.84,31.09 129.84,43.28 126.69,46.43 126.69,47.85 127.51,48.67 SERIAL.2
RXD
  Top 0.203: SERIAL.4 127.51,53.75 126.09,52.32 126.09,33.93 127.41,32.61 IC5.12
  Bottom 0.203: IC5.12 129.44,32 133.81,32 RN2.5
SSF  (via drill 0.25)
  Top 0.203: v45.92,47.65 45.62,47.95 45.62,50.6 IC2.10 | v64.92,54.46 63.7,53.24 v63.7,48.56
  Bottom 0.203: 61.16,48.56 61.16,47.65 v45.92,47.65 | 61.16,48.56 61.16,49.17 IC13.12 | v64.92,54.46 64.92,55.27 IC13.6 | 61.16,48.56 v63.7,48.56
TXD
  Top 0.203: IC5.10 129.13,27.53 130.45,28.85 130.45,55.47 129.64,56.29 SERIAL.5
VCC  (via drill 0.3)
  Top 0.61: v106.07,56.9 111.35,56.9 111.35,55.47 UART_PWR.1 111.96,52.53 111.96,37.9 112.17,37.69 IC5.15 113.89,36.58 114.81,35.66 114.81,2.95 | 114.81,2.95 107.19,2.95 107.19,10.26 | 114.81,2.95 123.65,2.95 127.1,6.4 IC5.2 | 107.19,10.26 107.19,13.41 IC4.28 | v77.22,8.43 79.05,10.26 107.19,10.26 | v42.67,17.58 v42.67,15.44 | v17.68,14.12 17.68,7.52 J1.7 | v58.93,54.56 v58.93,51.71 59.23,51.41 v59.23,38.3 59.44,38.1 59.44,35.46 v62.28,32.61 | IC2.24 22.76,58.22 23.67,57.3 23.67,47.85 20.83,45.01 20.83,42.77 19.51,41.45 19.51,34.75 v19.3,34.54 19.41,34.44 19.41,30.07 IC1.7 20.02,27.84 20.02,23.16 v20.22,22.96 | v71.42,57.1 69.8,55.47 v69.8,52.43
  Bottom 0.61: 77.32,60.35 77.32,57.4 74.68,57.4 IC10.32 73.36,57.1 v71.42,57.1 | 77.32,60.35 77.32,61.16 77.11,61.37 75.08,61.37 75.08,60.76 C5.2 | 77.32,60.35 93.27,60.35 C18.2 94.28,59.84 94.28,58.42 108,58.42 111.15,55.27 UART_PWR.1 | C8.1 115.32,37.39 114.2,37.39 IC5.15 | v106.07,56.9 93.98,56.9 IC12.32 | C6.2 107.19,16.87 107.19,15.75 IC4.28 | v77.22,8.43 77.22,7.52 J1.31 | IC8.16 46.13,15.14 44.91,15.14 C14.1 43.99,15.44 v42.67,15.44 | IC3.14 60.96,15.14 59.94,15.14 C15.1 59.13,15.65 59.13,16.87 56.39,16.87 55.47,17.78 42.67,17.78 | 42.67,17.78 40.84,17.78 40.13,17.07 33.83,17.07 32.11,15.34 IC9.16 31.8,15.14 30.58,15.14 C13.1 29.67,14.63 29.46,14.63 29.16,14.33 19.81,14.33 | 17.68,14.33 19.81,14.33 | 17.68,14.33 6.4,14.33 6.3,14.22 C7.1 | 20.42,22.05 24.69,22.05 25.5,21.23 RN1.1 | 20.42,22.05 19.81,21.44 19.81,14.33 | 42.67,17.78 v42.67,17.58 | 17.68,14.33 v17.68,14.12 | XO1.VDD 67.56,32.41 65.73,32.41 XO1.OE 64.92,32.11 63.8,32.11 63.2,31.5 C12.1 62.28,31.5 v62.28,32.61 | C17.1 57.61,50.9 58.62,50.9 IC13.14 58.93,51.1 v58.93,51.71 63.7,51.71 63.7,51.1 IC13.10 64.21,50.19 64.92,50.19 IC13.9 65.33,51.1 66.65,52.43 v69.8,52.43 | v58.93,54.56 58.93,55.27 IC13.1 | v59.23,38.3 59.23,37.59 IC11.16 58.83,37.39 57.61,37.39 C16.1 56.69,37.69 22.45,37.69 v19.3,34.54 14.94,34.54 11.58,37.9 IC6.3 10.67,38.1 8.43,38.1 C11.1 | IC2.24 21.95,59.13 20.32,59.13 C4.2 19.41,58.62 19.2,58.62 18.19,57.61 5.79,57.61 4.88,58.52 PWR.A | C3.1 19.91,31.19 19.91,30.07 IC1.7 | v20.22,22.96 20.22,22.25 20.42,22.05
X1
  Top 0.203: IC1.39 6.71,45.31 6.6,45.41 6.6,50.29 Q1.1
  Bottom 0.203: C2.2 6.4,53.44 6.4,51.31 Q1.1
X2
  Top 0.203: IC1.38 9.75,45.31 10.87,46.43 10.87,50.29 Q1.2
  Bottom 0.203: C1.2 11.18,53.44 11.18,51.31 Q1.2

### Text on the board
tPlace: Pugputer 6309 - CPU v2.1
tNames: /CTS | TXD | RXD | +5V | /RTS | GND